# Altium schematic sheet Sheet1.SchDoc
size B
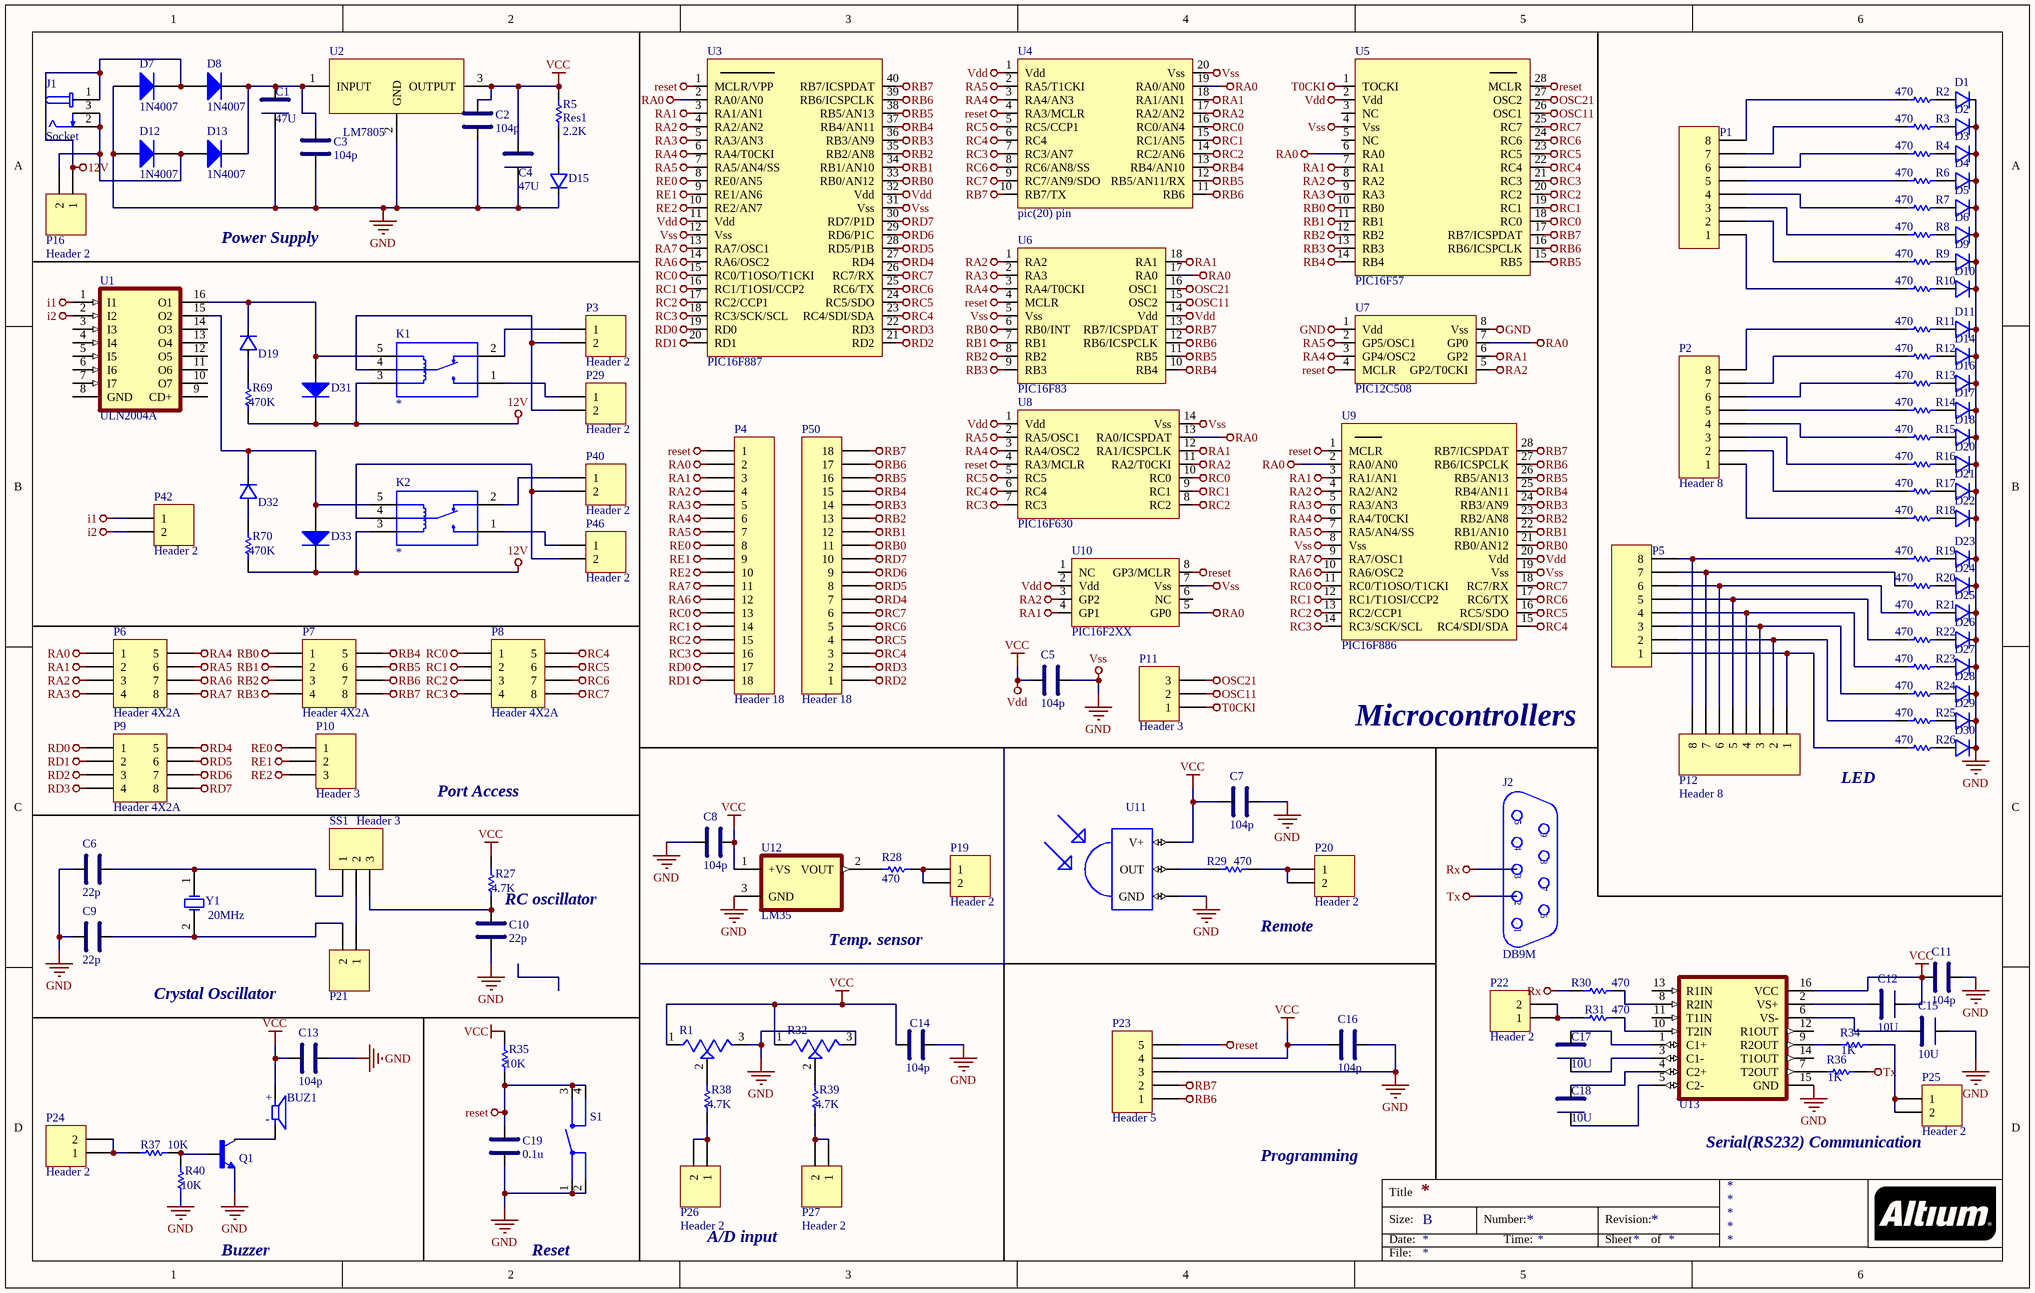
[diagram p0: Sheet1.SchDoc]

## Parts
BUZ1  CEM-1203(42)  [CUI_CEM-1203(42)]  (value not drawn)
C1  47U  [polarityCAP]
C2  value 104p  [cap]  (hidden comment: cap)
C3  104p  [cap]
C4  47U  [polarityCAP]
C5  value 104p  [cap]  (hidden comment: cap)
C6  value 22p  [cap]  (hidden comment: cap)
C7  value 104p  [cap]  (hidden comment: cap)
C8  value 104p  [cap]  (hidden comment: cap)
C9  value 22p  [cap]  (hidden comment: cap)
C10  value 22p  [cap]  (hidden comment: cap)
C11  value 104p  [cap]  (hidden comment: cap)
C12  value 10U  [polarityCAP]  (hidden comment: P.CAP)
C13  value 104p  [cap]  (hidden comment: cap)
C14  value 104p  [cap]  (hidden comment: cap)
C15  value 10U  [polarityCAP]  (hidden comment: P.CAP)
C16  value 104p  [cap]  (hidden comment: cap)
C17  value 10U  [polarityCAP]  (hidden comment: P.CAP)
C18  value 10U  [polarityCAP]  (hidden comment: P.CAP)
C19  value 0.1u  [cap]  (hidden comment: cap)
D1  LED  [PCBComponent_1]  (value not drawn)
D2  LED  [PCBComponent_1]  (value not drawn)
D3  LED  [PCBComponent_1]  (value not drawn)
D4  LED  [PCBComponent_1]  (value not drawn)
D5  LED  [PCBComponent_1]  (value not drawn)
D6  LED  [PCBComponent_1]  (value not drawn)
D7  1N4007  [DO-41]
D8  1N4007  [DO-41]
D9  LED  [PCBComponent_1]  (value not drawn)
D10  LED  [PCBComponent_1]  (value not drawn)
D11  LED  [PCBComponent_1]  (value not drawn)
D12  1N4007  [DO-41]
D13  1N4007  [DO-41]
D14  LED  [PCBComponent_1]  (value not drawn)
D15  LED  [PCBComponent_1]  (value not drawn)
D16  LED  [PCBComponent_1]  (value not drawn)
D17  LED  [PCBComponent_1]  (value not drawn)
D18  LED  [PCBComponent_1]  (value not drawn)
D19  LED  [PCBComponent_1]  (value not drawn)
D20  LED  [PCBComponent_1]  (value not drawn)
D21  LED  [PCBComponent_1]  (value not drawn)
D22  LED  [PCBComponent_1]  (value not drawn)
D23  LED  [PCBComponent_1]  (value not drawn)
D24  LED  [PCBComponent_1]  (value not drawn)
D25  LED  [PCBComponent_1]  (value not drawn)
D26  LED  [PCBComponent_1]  (value not drawn)
D27  LED  [PCBComponent_1]  (value not drawn)
D28  LED  [PCBComponent_1]  (value not drawn)
D29  LED  [PCBComponent_1]  (value not drawn)
D30  LED  [PCBComponent_1]  (value not drawn)
D31  Diode 1N4007  [DO-41]  (value not drawn)
D32  LED  [PCBComponent_1]  (value not drawn)
D33  Diode 1N4007  [DO-41]  (value not drawn)
J1  Socket  [GCT_DCJ235-05-A-XX-X_REVA]
J2  DB9M  [D-09M]
K1  1-1721150-0  [RELAY_ORWH-SH-105D1F,000]  (value not drawn)
K2  1-1721150-0  [RELAY_ORWH-SH-105D1F,000]  (value not drawn)
P1  Header 8  [HDR1X8]  (value not drawn)
P2  Header 8  [HDR1X8]
P3  Header 2  [HDR1X2]
P4  Header 18  [HDR1X18]
P5  Header 8  [HDR1X8]  (value not drawn)
P6  Header 4X2A  [HDR2X4_CEN]
P7  Header 4X2A  [HDR2X4_CEN]
P8  Header 4X2A  [HDR2X4_CEN]
P9  Header 4X2A  [HDR2X4_CEN]
P10  Header 3  [HDR1X3]
P11  Header 3  [HDR1X3]
P12  Header 8  [HDR1X8]
P16  Header 2  [HDR1X2]
P19  Header 2  [HDR1X2]
P20  Header 2  [HDR1X2]
P21  Header 2  [HDR1X2]  (value not drawn)
P22  Header 2  [HDR1X2]
P23  Header 5  [HDR1X5]
P24  Header 2  [HDR1X2]
P25  Header 2  [HDR1X2]
P26  Header 2  [HDR1X2]
P27  Header 2  [HDR1X2]
P29  Header 2  [HDR1X2]
P40  Header 2  [HDR1X2]
P42  Header 2  [HDR1X2]
P46  Header 2  [HDR1X2]
P50  Header 18  [HDR1X18]
Q1  2N5172  [TRANSISTOR_TO-92]  (value not drawn)
R1  3296W-1-103ALF  [TRIM_3296W-1-103ALF]  (value not drawn)
R2  value 470  [AXIAL-0.3]  (hidden comment: Res1)
R3  value 470  [AXIAL-0.3]  (hidden comment: Res1)
R4  value 470  [AXIAL-0.3]  (hidden comment: Res1)
R5  Res1  value 2.2K  [AXIAL-0.3]
R6  value 470  [AXIAL-0.3]  (hidden comment: Res1)
R7  value 470  [AXIAL-0.3]  (hidden comment: Res1)
R8  value 470  [AXIAL-0.3]  (hidden comment: Res1)
R9  value 470  [AXIAL-0.3]  (hidden comment: Res1)
R10  value 470  [AXIAL-0.3]  (hidden comment: Res1)
R11  value 470  [AXIAL-0.3]  (hidden comment: Res1)
R12  value 470  [AXIAL-0.3]  (hidden comment: Res1)
R13  value 470  [AXIAL-0.3]  (hidden comment: Res1)
R14  value 470  [AXIAL-0.3]  (hidden comment: Res1)
R15  value 470  [AXIAL-0.3]  (hidden comment: Res1)
R16  value 470  [AXIAL-0.3]  (hidden comment: Res1)
R17  value 470  [AXIAL-0.3]  (hidden comment: Res1)
R18  value 470  [AXIAL-0.3]  (hidden comment: Res1)
R19  value 470  [AXIAL-0.3]  (hidden comment: Res1)
R20  value 470  [AXIAL-0.3]  (hidden comment: Res1)
R21  value 470  [AXIAL-0.3]  (hidden comment: Res1)
R22  value 470  [AXIAL-0.3]  (hidden comment: Res1)
R23  value 470  [AXIAL-0.3]  (hidden comment: Res1)
R24  value 470  [AXIAL-0.3]  (hidden comment: Res1)
R25  value 470  [AXIAL-0.3]  (hidden comment: Res1)
R26  value 470  [AXIAL-0.3]  (hidden comment: Res1)
R27  value 4.7K  [AXIAL-0.3]  (hidden comment: Res1)
R28  value 470  [AXIAL-0.3]  (hidden comment: Res1)
R29  value 470  [AXIAL-0.3]  (hidden comment: Res1)
R30  value 470  [AXIAL-0.3]  (hidden comment: Res1)
R31  value 470  [AXIAL-0.3]  (hidden comment: Res1)
R32  3296W-1-103ALF  [TRIM_3296W-1-103ALF]  (value not drawn)
R34  value 1K  [AXIAL-0.3]  (hidden comment: Res1)
R35  value 10K  [AXIAL-0.3]  (hidden comment: Res1)
R36  value 1K  [AXIAL-0.3]  (hidden comment: Res1)
R37  value 10K  [AXIAL-0.3]  (hidden comment: Res1)
R38  value 4.7K  [AXIAL-0.3]  (hidden comment: Res1)
R39  value 4.7K  [AXIAL-0.3]  (hidden comment: Res1)
R40  value 10K  [AXIAL-0.3]  (hidden comment: Res1)
R69  value 470K  [AXIAL-0.3]  (hidden comment: Res1)
R70  value 470K  [AXIAL-0.3]  (hidden comment: Res1)
S1  SKHHANA010  [SW_SKHHANA010]  (value not drawn)
SS1  Header 3  [HDR1X3]
U1  ULN2004A  [ULN2004A]
U2  LM7805  [LM7805]
U3  PIC16F887  [PIC(40pin)]
U4  pic(20) pin  [PIC(20)piN]
U5  PIC16F57  [PIC(28) pin]
U6  PIC16F83  [pic16F54]
U7  PIC12C508  [PIC10F220]
U8  PIC16F630  [PIC16f630]
U9  PIC16F886  [PIC(28) pin]
U10  PIC16F2XX  [PIC10F220]
U11  1838V  [TSOP18XX]  (value not drawn)
U12  LM35  [TO127P254X495-3P]
U13  MAX232  [DIP794W45P254L1969H508Q16]  (value not drawn)
Y1  value 20MHz  [R38]  (hidden comment: XTAL)

## Nets
12V: D7.2(K) D8.1(A) D31.2(K) D33.2(K) J1.1 K1.3(C1) K2.3(C1) P16.1 R69.1 R70.1
GND: C1.2 C2.1 C3.1 C4.2 C5.1 C6.2 C7.1 C8.2 C9.2 C10.1 C11.1 C13.1 C14.1 C15.2 C16.1 C19.1 D1.2 D2.2 D3.2 D4.2 D5.2 D6.2 D7.1(A) D9.2 D10.2 D11.2 D12.1(A) D14.2 D15.2 D16.2 D17.2 D18.2 D20.2 D21.2 D22.2 D23.2 D24.2 D25.2 D26.2 D27.2 D28.2 D29.2 D30.2 P23.3 Q1.3(E) R1.3(CW) R32.3(CW) R40.1 S1.1 S1.2 U2.2(GND) U3.12(Vss) U3.31(Vss) U4.20(Vss) U5.4(Vss) U6.5(Vss) U7.1(Vdd) U7.8(Vss) U8.14(Vss) U9.8(Vss) U9.19(Vss) U10.7(Vss) U11.GND U12.3(GND) U13.15(GND)  [also labelled Vss]
i1: P42.1 U1.1(I1)
i2: P42.2 U1.2(I2)
OSC11: P11.2 U5.26(OSC1) U6.15(OSC2)
OSC21: P11.3 U5.27(OSC2) U6.16(OSC1)
RA0: P4.2 P6.1 U3.2(RA0/AN0) U4.19(RA0/AN0) U5.6(RA0) U6.17(RA0) U7.7(GP0) U8.13(RA0/ICSPDAT) U9.2(RA0/AN0) U10.5(GP0)
RA1: P4.3 P6.2 U3.3(RA1/AN1) U4.18(RA1/AN1) U5.7(RA1) U6.18(RA1) U7.6(GP2) U8.12(RA1/ICSPCLK) U9.3(RA1/AN1) U10.4(GP1)
RA2: P4.4 P6.3 U3.4(RA2/AN2) U4.17(RA2/AN2) U5.8(RA2) U6.1(RA2) U7.5(GP2/T0CKI) U8.11(RA2/T0CKI) U9.4(RA2/AN2) U10.3(GP2)
RA3: P4.5 P6.4 U3.5(RA3/AN3) U5.9(RA3) U6.2(RA3) U9.5(RA3/AN3)
RA4: P4.6 P6.5 U3.6(RA4/T0CKI) U4.3(RA4/AN3) U6.3(RA4/T0CKI) U7.3(GP4/OSC2) U8.3(RA4/OSC2) U9.6(RA4/T0CKI)
RA5: P4.7 P6.6 U3.7(RA5/AN4/SS) U4.2(RA5/T1CKI) U7.2(GP5/OSC1) U8.2(RA5/OSC1) U9.7(RA5/AN4/SS)
RA6: P4.12 P6.7 U3.14(RA6/OSC2) U9.10(RA6/OSC2)
RA7: P4.11 P6.8 U3.13(RA7/OSC1) U9.9(RA7/OSC1)
RB0: P7.1 P50.11 U3.33(RB0/AN12) U5.10(RB0) U6.6(RB0/INT) U9.21(RB0/AN12)
RB1: P7.2 P50.12 U3.34(RB1/AN10) U5.11(RB1) U6.7(RB1) U9.22(RB1/AN10)
RB2: P7.3 P50.13 U3.35(RB2/AN8) U5.12(RB2) U6.8(RB2) U9.23(RB2/AN8)
RB3: P7.4 P50.14 U3.36(RB3/AN9) U5.13(RB3) U6.9(RB3) U9.24(RB3/AN9)
RB4: P7.5 P50.15 U3.37(RB4/AN11) U4.13(RB4/AN10) U5.14(RB4) U6.10(RB4) U9.25(RB4/AN11)
RB5: P7.6 P50.16 U3.38(RB5/AN13) U4.12(RB5/AN11/RX) U5.15(RB5) U6.11(RB5) U9.26(RB5/AN13)
RB6: P7.7 P23.1 P50.17 U3.39(RB6/ICSPCLK) U4.11(RB6) U5.16(RB6/ICSPCLK) U6.12(RB6/ICSPCLK) U9.27(RB6/ICSPCLK)
RB7: P7.8 P23.2 P50.18 U3.40(RB7/ICSPDAT) U4.10(RB7/TX) U5.17(RB7/ICSPDAT) U6.13(RB7/ICSPDAT) U9.28(RB7/ICSPDAT)
RC0: P4.13 P8.1 U3.15(RC0/T1OSO/T1CKI) U4.16(RC0/AN4) U5.18(RC0) U8.10(RC0) U9.11(RC0/T1OSO/T1CKI)
RC1: P4.14 P8.2 U3.16(RC1/T1OSI/CCP2) U4.15(RC1/AN5) U5.19(RC1) U8.9(RC1) U9.12(RC1/T1OSI/CCP2)
RC2: P4.15 P8.3 U3.17(RC2/CCP1) U4.14(RC2/AN6) U5.20(RC2) U8.8(RC2) U9.13(RC2/CCP1)
RC3: P4.16 P8.4 U3.18(RC3/SCK/SCL) U4.7(RC3/AN7) U5.21(RC3) U8.7(RC3) U9.14(RC3/SCK/SCL)
RC4: P8.5 P50.3 U3.23(RC4/SDI/SDA) U4.6(RC4) U5.22(RC4) U8.6(RC4) U9.15(RC4/SDI/SDA)
RC5: P8.6 P50.4 U3.24(RC5/SDO) U4.5(RC5/CCP1) U5.23(RC5) U8.5(RC5) U9.16(RC5/SDO)
RC6: P8.7 P50.5 U3.25(RC6/TX) U4.8(RC6/AN8/SS) U5.24(RC6) U9.17(RC6/TX)
RC7: P8.8 P50.6 U3.26(RC7/RX) U4.9(RC7/AN9/SDO) U5.25(RC7) U9.18(RC7/RX)
RD0: P4.17 P9.1 U3.19(RD0)
RD1: P4.18 P9.2 U3.20(RD1)
RD2: P9.3 P50.1 U3.21(RD2)
RD3: P9.4 P50.2 U3.22(RD3)
RD4: P9.5 P50.7 U3.27(RD4)
RD5: P9.6 P50.8 U3.28(RD5/P1B)
RD6: P9.7 P50.9 U3.29(RD6/P1C)
RD7: P9.8 P50.10 U3.30(RD7/P1D)
RE0: P4.8 P10.1 U3.8(RE0/AN5)
RE1: P4.9 P10.2 U3.9(RE1/AN6)
RE2: P4.10 P10.3 U3.10(RE2/AN7)
reset: C19.2 P4.1 P23.5 R35.1 S1.3 S1.4 U3.1(MCLR/VPP) U4.4(RA3/MCLR) U5.28(MCLR) U6.4(MCLR) U7.4(MCLR) U8.4(RA3/MCLR) U9.1(MCLR) U10.8(GP3/MCLR)
Rx: J2.3 R30.1
T0CKI: P11.1 U5.1(TOCKI)
Tx: J2.2 R36.2
VCC: BUZ1.P C2.2 C4.1 C5.2 C7.2 C8.1 C11.2 C12.2 C13.2 C14.2 C16.2 P23.4 R1.1(CCW) R5.2 R27.2 R32.1(CCW) R35.2 U2.3(OUTPUT) U3.11(Vdd) U3.32(Vdd) U4.1(Vdd) U5.2(Vdd) U6.14(Vdd) U8.1(Vdd) U9.20(Vdd) U10.2(Vdd) U11.VCC(V+) U12.1(+VS) U13.16(VCC)  [also labelled Vdd]
NetBUZ1_N: BUZ1.N Q1.1(C)
NetC1_1: C1.1 C3.2 D8.2(K) D13.2(K) U2.1(INPUT)
NetC6_1: C6.1 SS1.1 Y1.1(OSC1)
NetC9_1: C9.1 P21.2 Y1.2(OSC2)
NetC10_2: C10.2 R27.1 SS1.3
NetC12_1: C12.1 U13.2(VS+)
NetC15_1: C15.1 U13.6(VS-)
NetC17_1: C17.1 U13.1(C1+)
NetC17_2: C17.2 U13.3(C1-)
NetC18_1: C18.1 U13.4(C2+)
NetC18_2: C18.2 U13.5(C2-)
NetD1_1: D1.1 R2.2
NetD2_1: D2.1 R3.2
NetD3_1: D3.1 R4.2
NetD4_1: D4.1 R6.2
NetD5_1: D5.1 R7.2
NetD6_1: D6.1 R8.2
NetD9_1: D9.1 R9.2
NetD10_1: D10.1 R10.2
NetD11_1: D11.1 R11.2
NetD12_2: D12.2(K) D13.1(A) J1.2 J1.3 P16.2
NetD14_1: D14.1 R12.2
NetD15_1: D15.1 R5.1
NetD16_1: D16.1 R13.2
NetD17_1: D17.1 R14.2
NetD18_1: D18.1 R15.2
NetD19_1: D19.1 R69.2
NetD19_2: D19.2 D31.1(A) K1.5(C2) U1.16(O1)
NetD20_1: D20.1 R16.2
NetD21_1: D21.1 R17.2
NetD22_1: D22.1 R18.2
NetD23_1: D23.1 R19.2
NetD24_1: D24.1 R20.2
NetD25_1: D25.1 R21.2
NetD26_1: D26.1 R22.2
NetD27_1: D27.1 R23.2
NetD28_1: D28.1 R24.2
NetD29_1: D29.1 R25.2
NetD30_1: D30.1 R26.2
NetD32_1: D32.1 R70.2
NetD32_2: D32.2 D33.1(A) K2.5(C2) U1.15(O2)
NetK1_1: K1.1(NO) P29.1
NetK1_2: K1.2(NC) P3.1
NetK1_4: K1.4(C) P3.2 P29.2
NetK2_1: K2.1(NO) P46.1
NetK2_2: K2.2(NC) P40.1
NetK2_4: K2.4(C) P40.2 P46.2
NetP1_1: P1.1 R10.1
NetP1_2: P1.2 R9.1
NetP1_3: P1.3 R8.1
NetP1_4: P1.4 R7.1
NetP1_5: P1.5 R6.1
NetP1_6: P1.6 R4.1
NetP1_7: P1.7 R3.1
NetP1_8: P1.8 R2.1
NetP2_1: P2.1 R18.1
NetP2_2: P2.2 R17.1
NetP2_3: P2.3 R16.1
NetP2_4: P2.4 R15.1
NetP2_5: P2.5 R14.1
NetP2_6: P2.6 R13.1
NetP2_7: P2.7 R12.1
NetP2_8: P2.8 R11.1
NetP5_1: P5.1 P12.1 R26.1
NetP5_2: P5.2 P12.2 R25.1
NetP5_3: P5.3 P12.3 R24.1
NetP5_4: P5.4 P12.4 R23.1
NetP5_5: P5.5 P12.5 R22.1
NetP5_6: P5.6 P12.6 R21.1
NetP5_7: P5.7 P12.7 R20.1
NetP5_8: P5.8 P12.8 R19.1
NetP19_1: P19.1 P19.2 R28.1
NetP20_1: P20.1 P20.2 R29.2
NetP21_1: P21.1 SS1.2
NetP22_1: P22.1 P22.2 R31.1
NetP24_1: P24.1 P24.2 R37.2
NetP25_1: P25.1 P25.2 R34.2
NetP26_1: P26.1 P26.2 R38.1
NetP27_1: P27.1 P27.2 R39.1
NetQ1_2: Q1.2(B) R37.1 R40.2
NetR1_2: R1.2(WIPER) R38.2
NetR28_2: R28.2 U12.2(VOUT)
NetR29_1: R29.1 U11.OUT
NetR30_2: R30.2 U13.8(R2IN)
NetR31_2: R31.2 U13.10(T2IN)
NetR32_2: R32.2(WIPER) R39.2
NetR34_1: R34.1 U13.9(R2OUT)
NetR36_1: R36.1 U13.7(T2OUT)

Not connected (* = marked no-connect by the designer): J2 1 4 5 6 7 8 9; U1 3(I3) 4(I4) 5(I5) 6(I6) 7(I7) 8(GND) 9(CD+) 10(O7) 11(O6) 12(O5) 13(O4) 14(O3); U5 3(NC) 5(NC); U10 1(NC) 6(NC); U13 11(T1IN) 12(R1OUT) 13(R1IN) 14(T1OUT)

## Notes on the sheet
- Power Supply
- Microcontrollers
- Port Access
- LED
- RC oscillator
- Temp. sensor
- Remote
- Crystal Oscillator
- Programming
- (near P25) Serial(RS232) Communication
- A/D input
- Buzzer
- Reset
- Title
- Size:
- Date:
- B
- Number:
- Time:
- Revision:
- Sheet
- of
- File:
- (in symbol CEM-1203(42)) +; -

## Library data of the parts
BUZ1 = CEM-1203(42): 12 mm, 3.5 V, 85 dB, Through Hole, Magnetic Audio Transducer Buzzer; MF: CUI Devices; MP: CEM-1203_42_; Value: *; Price: None; Package: TO-220 CUI Inc.; CUI_purchase_URL: https://www.cuidevices.com/product/audio/buzzers/audio-transducers/cem-1203_42_?utm_source=snapeda.com&utm_medium=referral&utm_campaign=snapedaBOM; Availability: Unavailable; SnapEDA_Link: https://www.snapeda.com/parts/CEM-1203%2842%29/CUI%20Devices/view-part/1320038/?ref=snap
C1 C4 C12 C15 C17 C18 = CAP
  C1 C4: Value: 47U
C3 = cap: Value: 104p
D7 D8 D12 D13 D31 D33 = Diode 1N4007: 1 Amp General Purpose Rectifier; Published: 8-Jun-2000; LatestRevisionDate: 17-Jul-2002; LatestRevisionNote: Re-released for DXP Platform.; DatasheetVersion: 1998; PackageVersion: Aug-1999; PackageReference: DO-41; Publisher: Altium Limited; PackageDescription: Diode, Axial; Body 5.2 x 2.7 mm (LxDia. max), Lead Dia. 0.86 mm (max); Code_JEDEC: DO-204-AL; ComponentLink1Description: Manufacturer Link; ComponentLink1URL: http://www.fairchildsemi.com/; ComponentLink2Description: Datasheet; ComponentLink2URL: http://www.fairchildsemi.com/ds/1N%2F1N4001.pdf
J1 = DCJ235-05-A-XX-X_REVA: Dc Power Jack, 5a, 20vdc, Black; MF: Global Connector Technology; MP: DCJ235-05-A-K1-A; Price: None; Availability: Unavailable; Package: None; SnapEDA_Link: https://www.snapeda.com/parts/DCJ235-05-A-K1-A/Global%20Connector%20Technology/view-part/813042/?ref=snap; Value: *
J2 = DB9M: Adapter Connector D-Sub, 9 Pin Male To D-Sub, 9 Pin Male Free Hanging _In-Line_; MF: NorComp Inc.; Package: None; Price: None; MP: DB9M; Availability: Unavailable; SnapEDA_Link: https://www.snapeda.com/parts/DB9M/NorComp%20Inc./view-part/558713/?ref=snap; Value: *
K1 K2 = ORWH-SH-105D1F,000: Electromechanical Relay 5VDC 15A SPDT __ 19.2mm 15.5mm 15mm__ THT General Purpose Relay; MF: TE Connectivity; Price: None; Value: *; TE_purchase_URL: https://www.te.com/usa-en/product-1-1721150-0.html?te_bu=Cor&te_type=disp&te_campaign=seda_glo_cor-seda-global-disp-prtnr-fy19-seda-model-bom-cta_sma-317_1&elqCampaignId=32493; Package: None; SnapEDA_Link: https://www.snapeda.com/parts/ORWH-SH-105D1F%2C000/TE%20Connectivity%20Potter%20%26%20Brumfield%20Relays/view-part/573992/?ref=snap; MP: ORWH-SH-105D1F,000; Availability: Unavailable; Comment_1: *
P1 P2 P5 P12 = Header 8: Header, 8-Pin; LatestRevisionDate: 17-Jul-2002; LatestRevisionNote: Re-released for DXP Platform.; Publisher: Altium Limited
P3 P16 P19-P22 P24-P27 P29 P40 P42 P46 = Header 2: Header, 2-Pin; LatestRevisionDate: 17-Jul-2002; LatestRevisionNote: Re-released for DXP Platform.; Publisher: Altium Limited
P4 P50 = Header 18: Header, 18-Pin; LatestRevisionDate: 17-Jul-2002; LatestRevisionNote: Re-released for DXP Platform.; Publisher: Altium Limited
P6-P9 = Header 4X2A: Header, 4-Pin, Dual row; LatestRevisionDate: 17-Jul-2002; LatestRevisionNote: Re-released for DXP Platform.; Publisher: Altium Limited
P10 P11 SS1 = Header 3: Header, 3-Pin; LatestRevisionDate: 17-Jul-2002; LatestRevisionNote: Re-released for DXP Platform.; Publisher: Altium Limited
P23 = Header 5: Header, 5-Pin; LatestRevisionDate: 17-Jul-2002; LatestRevisionNote: Re-released for DXP Platform.; Publisher: Altium Limited
Q1 = 2N5172: Bipolar (BJT) Transistor NPN 25V 500mA 625mW Through Hole TO-92-3; MF: ON Semiconductor; Package: TO-92 ON Semiconductor; DigiKey-Purchase-URL: https://snapeda.com/shop?store=DigiKey&id=2663226; Value: *; Availability: Warning; SnapEDA_Link: https://www.snapeda.com/parts/2N5172/ON%20Semiconductor/view-part/2663226/?ref=snap; Price: None; MP: 2N5172
R1 R32 = 3296W-1-103ALF: 10 kOhms 0.5W, 1 / 2W PC Pins qua lá»— Trimmer Potentiometer Cermet 25 Turn Top Äiá»u chá»‰nh; MF: Bourns; Value: *; Price: None; Package: 1005 Bourns; Mouser-Purchase-URL: https://snapeda.com/shop?store=Mouser&id=697371; Availability: Warning; SnapEDA_Link: https://www.snapeda.com/parts/3296W-1-103ALF/Bourns/view-part/697371/?ref=snap; MP: 3296W-1-103ALF
R2-R31 R34-R40 R69 R70 = Res1: Resistor; Published: 8-Jun-2000; LatestRevisionDate: 17-Jul-2002; LatestRevisionNote: Re-released for DXP Platform.; PackageReference: AXIAL-0.3; Publisher: Altium Limited; PackageDescription: Axial Device, Thru-Hole; 2 Leads; 0.3 in Pin Spacing
S1 = SKHHANA010: Switch Tactile N.O. SPST Round Button PC Pins 0.05A 12VDC 0.98N Thru-Hole Bulk; MF: ALPS; Value: *; SnapEDA_Link: https://www.snapeda.com/parts/SKHHANA010/ALPS/view-part/248805/?ref=snap; Price: None; Availability: Unavailable; Package: None; MP: SKHHANA010
U1 = ULN2004A: MF: STMicroelectronics; DigiKey-Purchase-URL: https://snapeda.com/shop?store=DigiKey&id=45236; Package: DIP-16 STMicroelectronics; MP: ULN2004A; Value: *; SnapEDA_Link: https://www.snapeda.com/parts/ULN2004A/STMicroelectronics/view-part/45236/?ref=snap; Availability: Unavailable; Price: None
U2 = Component_1
U3 = PIC(40)pin
U6 = pic(18) pin
U7 = PIC(8)pin
U8 = PIC(14) pin
U9 = PIC(28)pin
U11 = 1838V: Remote Receiver Sensor, 38.0kHz 45m Through Hole; MP: TSOP4838; MF: Vishay; Price: None; SnapEDA_Link: https://www.snapeda.com/parts/TSOP4838/Vishay%20Semiconductor%20Opto%20Division/view-part/702087/?ref=snap; Value: *; Availability: Unavailable; Package: None
U12 = LM35: &plusmn;0.5&deg;C 4V-30V, Temperature sensor with analog output 3-TO-92; MF: Texas Instruments; MP: LM35CZ/LFT1; Value: *; SnapEDA_Link: https://www.snapeda.com/parts/LM35CZ/LFT1/Texas%20Instruments/view-part/18854/?ref=snap; Texas_Instruments-Purchase-URL: https://snapeda.com/shop?store=Texas+Instruments&id=18854; Availability: Warning; Price: None; Package: TO-92-3 Texas Instruments
U13 = MAX232N: Dual EIA-232 Driver/Receiver; MF: Texas Instruments; MP: MAX232N; Availability: Unavailable; DigiKey-Purchase-URL: https://snapeda.com/shop?store=DigiKey&id=552531; SnapEDA_Link: https://www.snapeda.com/parts/MAX232N/Texas%20Instruments/view-part/552531/?ref=snap; Mouser-Purchase-URL: https://snapeda.com/shop?store=Mouser&id=552531; Value: *; Price: None; Package: PDIP-16 Texas Instruments
Y1 = XTAL: Crystal Oscillator; Published: 8-Jun-2000; LatestRevisionDate: 17-Jul-2002; LatestRevisionNote: Re-released for DXP Platform.; PackageReference: R38; Publisher: Altium Limited; PackageDescription: Crystal, Thru-Hole; 2 Leads; Body 3.1 x 8.2 mm (Dia.xH)